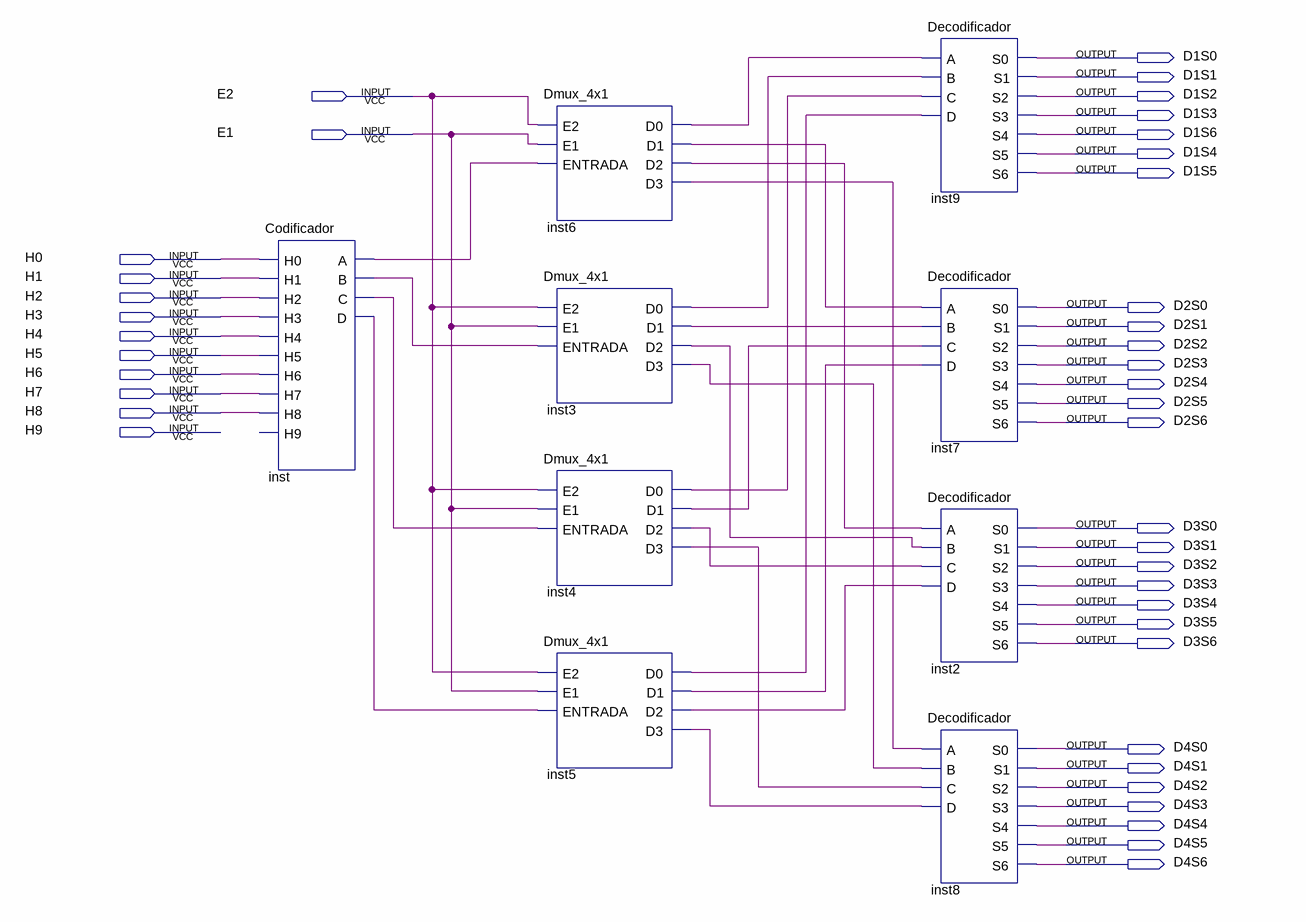
[diagram p0: schematic sheet]
// Quartus schematic Relogio.bdf as structural Verilog: 9 symbols, 40 pins
module Relogio (
  input  E2,
  input  E1,
  input  H0,
  input  H1,
  input  H2,
  input  H3,
  input  H4,
  input  H5,
  input  H6,
  input  H7,
  input  H8,
  input  H9,
  output D1S0,
  output D1S1,
  output D1S2,
  output D1S3,
  output D1S6,
  output D1S4,
  output D1S5,
  output D2S0,
  output D2S1,
  output D2S2,
  output D2S3,
  output D2S4,
  output D2S5,
  output D2S6,
  output D3S0,
  output D3S1,
  output D3S2,
  output D3S3,
  output D3S4,
  output D3S5,
  output D3S6,
  output D4S0,
  output D4S1,
  output D4S2,
  output D4S3,
  output D4S4,
  output D4S5,
  output D4S6
);

  wire inst3_d0, inst3_d1, inst3_d2, inst3_d3, inst4_d0, inst4_d1, inst4_d2, inst4_d3, inst5_d0, inst5_d1,
       inst5_d2, inst5_d3, inst6_d0, inst6_d1, inst6_d2, inst6_d3, inst_a, inst_b, inst_c, inst_d;

  Codificador inst (
    .H0(H0), .H1(H1), .H2(H2), .H3(H3), .H4(H4), .H5(H5), .H6(H6), .H7(H7), .H8(H8), .A(inst_a), .B(inst_b),
    .C(inst_c), .D(inst_d));  // open: H9
  Dmux_4x1 inst6 (.E2(E2), .E1(E1), .ENTRADA(inst_a), .D0(inst6_d0), .D1(inst6_d1), .D2(inst6_d2), .D3(inst6_d3));
  Dmux_4x1 inst3 (.E2(E2), .E1(E1), .ENTRADA(inst_b), .D0(inst3_d0), .D1(inst3_d1), .D2(inst3_d2), .D3(inst3_d3));
  Dmux_4x1 inst4 (.E2(E2), .E1(E1), .ENTRADA(inst_c), .D0(inst4_d0), .D1(inst4_d1), .D2(inst4_d2), .D3(inst4_d3));
  Dmux_4x1 inst5 (.E2(E2), .E1(E1), .ENTRADA(inst_d), .D0(inst5_d0), .D1(inst5_d1), .D2(inst5_d2), .D3(inst5_d3));
  Decodificador inst9 (
    .A(inst6_d0), .B(inst3_d0), .C(inst4_d0), .D(inst5_d0), .S0(D1S0), .S1(D1S1), .S2(D1S2), .S3(D1S3),
    .S4(D1S6), .S5(D1S4), .S6(D1S5));
  Decodificador inst7 (
    .A(inst6_d1), .B(inst3_d1), .C(inst4_d1), .D(inst5_d1), .S0(D2S0), .S1(D2S1), .S2(D2S2), .S3(D2S3),
    .S4(D2S4), .S5(D2S5), .S6(D2S6));
  Decodificador inst2 (
    .A(inst6_d2), .B(inst3_d2), .C(inst4_d2), .D(inst5_d2), .S0(D3S0), .S1(D3S1), .S2(D3S2), .S3(D3S3),
    .S4(D3S4), .S5(D3S5), .S6(D3S6));
  Decodificador inst8 (
    .A(inst6_d3), .B(inst3_d3), .C(inst4_d3), .D(inst5_d3), .S0(D4S0), .S1(D4S1), .S2(D4S2), .S3(D4S3),
    .S4(D4S4), .S5(D4S5), .S6(D4S6));
endmodule
